# EAGLE design adn_Lego (EAGLE 9.6.2)
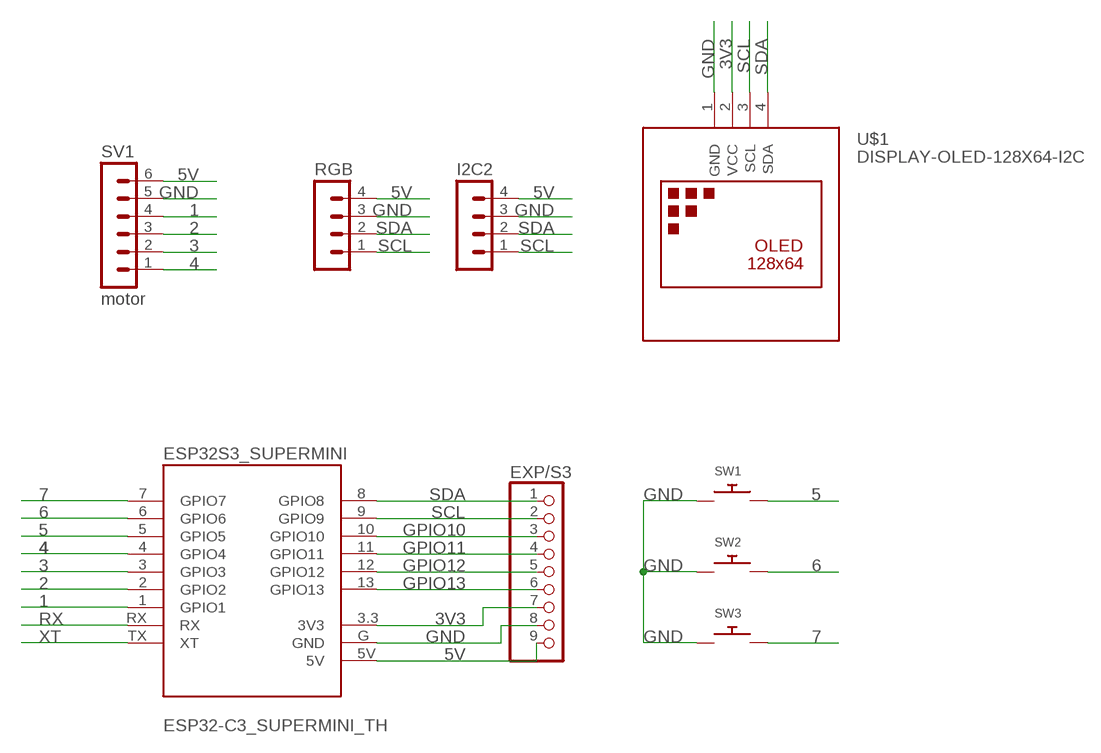
[diagram p0: schematic, sheet 1]

## Parts
ESP32S3_SUPERMINI  ESP32-C3_SUPERMINI_TH  [MODULE_ESP32-C3_SUPERMINI_TH]
EXP/S3  PINHD-1X9  [1X09]
I2C2  MA04-1  [MA04-1]
RGB  MA04-1  [MA04-1]
SV1  motor  MA06-1  [MA06-1]
SW1  SWITCH_PUSHBUTTONEVQ-PE  [TACT_PANA-EVQ]
SW2  SWITCH_PUSHBUTTONEVQ-PE  [TACT_PANA-EVQ]
SW3  SWITCH_PUSHBUTTONEVQ-PE  [TACT_PANA-EVQ]
U$1  DISPLAY-OLED-128X64-I2C  [DISPLAY-OLED-128X64-I2C]

## Nets
1: ESP32S3_SUPERMINI.1(GPIO1) SV1.4
2: ESP32S3_SUPERMINI.2(GPIO2) SV1.3
3: ESP32S3_SUPERMINI.3(GPIO3) SV1.2
3V3: ESP32S3_SUPERMINI.3.3(3V3) EXP/S3.7 U$1.2(VCC)
4: ESP32S3_SUPERMINI.4(GPIO4) SV1.1
5: ESP32S3_SUPERMINI.5(GPIO5) SW1.P$2
5V: ESP32S3_SUPERMINI.5V EXP/S3.9 I2C2.4 RGB.4 SV1.6
6: ESP32S3_SUPERMINI.6(GPIO6) SW2.P$2
7: ESP32S3_SUPERMINI.7(GPIO7) SW3.P$2
GND: ESP32S3_SUPERMINI.G(GND) EXP/S3.8 I2C2.3 RGB.3 SV1.5 SW1.P$1 SW2.P$1 SW3.P$1 U$1.1(GND)
GPIO10: ESP32S3_SUPERMINI.10(GPIO10) EXP/S3.3
GPIO11: ESP32S3_SUPERMINI.11(GPIO11) EXP/S3.4
GPIO12: ESP32S3_SUPERMINI.12(GPIO12) EXP/S3.5
GPIO13: ESP32S3_SUPERMINI.13(GPIO13) EXP/S3.6
RX: ESP32S3_SUPERMINI.RX
SCL: ESP32S3_SUPERMINI.9(GPIO9) EXP/S3.2 I2C2.1 RGB.1 U$1.3(SCL)
SDA: ESP32S3_SUPERMINI.8(GPIO8) EXP/S3.1 I2C2.2 RGB.2 U$1.4(SDA)
XT: ESP32S3_SUPERMINI.TX(XT)

## Library data of the parts
ESP32S3_SUPERMINI = ESP32-S3_SUPERMINI_TH:ESP32-C3_SUPERMINI_TH: Biblioteca modificada para esp32 s3 super mini; AVAILABILITY: Not in stock; DESCRIPTION: Super tiny ESP32-S3; MARCA: model S3 esp32; MF: Espressif Systems; MODEL: esp32 S3; MP: ESP32-S3 SuperMini_TH; PACKAGE: Package
EXP/S3 = pinhead:PINHD-1X9: PIN HEADER
I2C2 RGB = con-lstb:MA04-1: PIN HEADER; OC_FARNELL: unknown; OC_NEWARK: unknown
SV1 = con-lstb:MA06-1: PIN HEADER; OC_FARNELL: unknown; OC_NEWARK: unknown
SW1-SW3 = adafruit:SWITCH_PUSHBUTTON: Buttons SOFTTOUCHSMD_SJ - Soft touch temporary push button (Super Junk Akihabara) Compatible with SKPMANE010 [Mouser: 688-SKPMAN] C&K_KSS = Digikey: KSS221GLFS
U$1 = diy-modules:DISPLAY-OLED-128X64-I2C: 128x64 Dot Matrix OLED Module based on SSD1306 chip Variant with I2C interface More details available here: http://www.instructables.com/id/Monochrome-096-i2c-OLED-display-with-arduino-SSD13/ SSD1306 datasheet: https://cdn-shop.adafruit.com/datasheets/SSD1306.pdf Click here to find device on ebay.com <http://www.ebay.com/sch/oled+display+128x64+iic> Note: There are two variants: I2C and SPI. Search for the proper version.

## Board
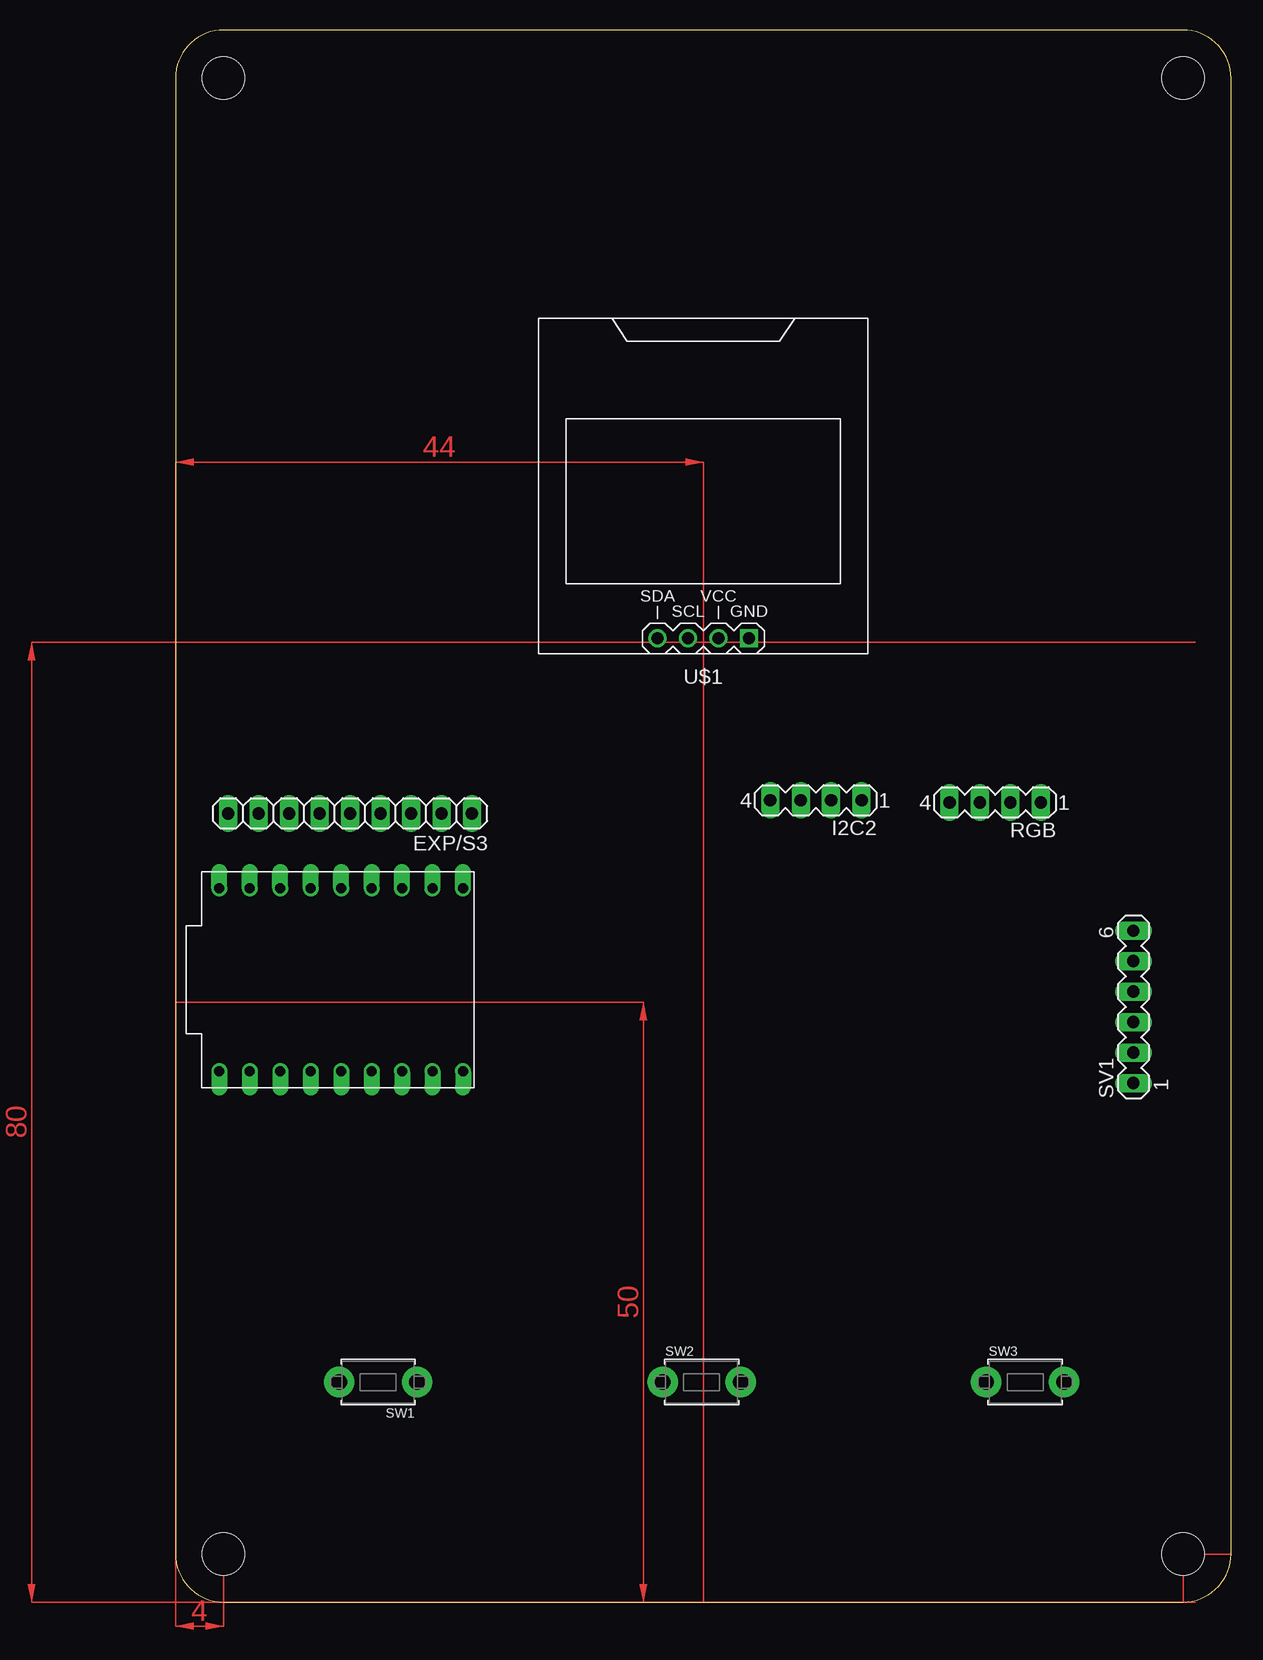
[diagram p1: board, top side]
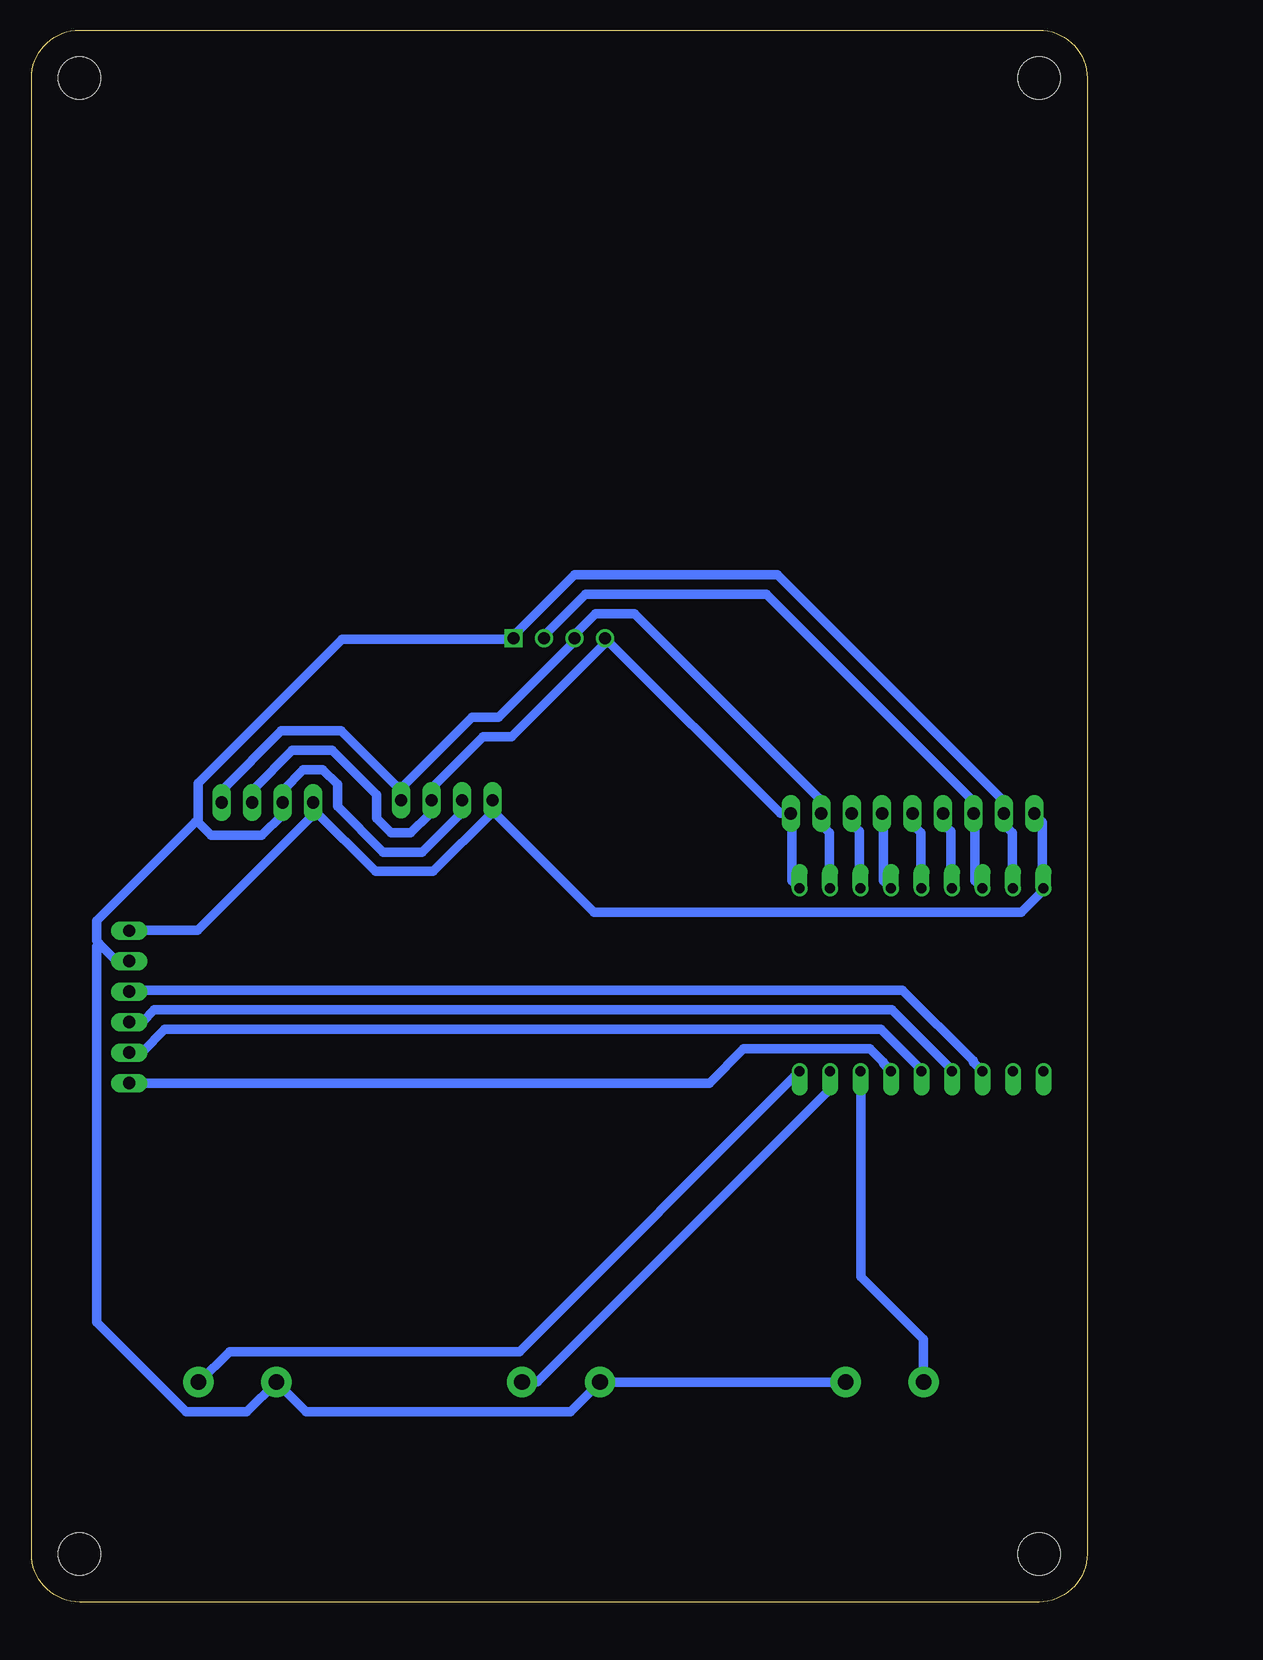
[diagram p2: board, bottom side, seen from below]

Size 88 x 131 mm. Coordinates in mm from the lower left corner, seen from the top.
Outline: 0,127 0,4 arc90 4,0 84,0 arc90 88,4 88,127 arc90 84,131 4,131 arc90 0,127
Copper layers (1*16): Top 0.035mm / dielectric 1.5mm / Bottom 0.035mm
Design rules "default *": minimum track width 0.8mm, minimum drill 0.8mm, track to track 0.8mm, track to pad 0.8mm, pad to pad 0.8mm, via to via 0.8mm, smd to smd 6mil, copper to edge 0.8mm, drill to drill 0.8mm, minimum pad ring 10mil, minimum via ring 8mil, stop-mask expansion 4mil, vias tented up to drill 0mil, thermal gap 10mil
Holes 3.5 mm at 4,127 4,4 84,4 84,127

### Footprints (pad centres in the part's own frame; a part is rotated, then mirrored left to right if it is on the bottom)
MODULE_ESP32-C3_SUPERMINI_TH = drill 0.84 offset: 1 -7.62,4.82; 2 -7.62,2.28; 3 -7.62,-0.26; 3.3 7.62,4.82; 4 -7.62,-2.8; 5 -7.62,-5.34; 5V 7.62,9.9; 6 -7.62,-7.88; 7 -7.62,-10.42; 8 7.62,-10.42; 9 7.62,-7.88; 10 7.62,-5.34; 11 7.62,-2.8; 12 7.62,-0.26; 13 7.62,2.28; G 7.62,7.36; RX -7.62,7.36; TX -7.62,9.9
1X09 = drill 1.016 long: 1 -10.16,0; 2 -7.62,0; 3 -5.08,0; 4 -2.54,0; 5 0,0; 6 2.54,0; 7 5.08,0; 8 7.62,0; 9 10.16,0
MA04-1 = drill 1.016 long: 1 -3.81,0; 2 -1.27,0; 3 1.27,0; 4 3.81,0
MA06-1 = drill 1.016 long: 1 -6.35,0; 2 -3.81,0; 3 -1.27,0; 4 1.27,0; 5 3.81,0; 6 6.35,0
TACT_PANA-EVQ = drill 1.3 pad 2.54: P$1 -3.25,0; P$2 3.25,0
DISPLAY-OLED-128X64-I2C = drill 1 square: 1 -3.81,12.7 | drill 1: 2 -1.27,12.7; 3 1.27,12.7; 4 3.81,12.7

### Placement (x,y rotation side)
ESP32S3_SUPERMINI  13.55,51.85 90 top
EXP/S3  14.55,65.71 180 top
I2C2  53.39,66.81 180 top
RGB  68.34,66.63 180 top
SV1  79.86,49.6 90 top
SW1  16.89,18.32 180 top
SW2  43.86,18.32 0 top
SW3  70.83,18.32 0 top
U$1  44,93 180 top

### Tracks (layer width: path | path; a pad name or v marks a point on that pad's centre or on a via)
1
  Bottom 0.8: ESP32S3_SUPERMINI.1 9.5,45 9.5,45.11 15.39,51 79.62,51 79.76,50.87 SV1.4
2
  Bottom 0.8: SV1.3 79.81,48.38 78.75,48.38 77.78,49.35 16.28,49.35 11.38,44.45 11.38,44.34 ESP32S3_SUPERMINI.2
3
  Bottom 0.8: SV1.2 79.77,45.88 78.75,45.88 76.9,47.73 17.2,47.73 13.88,44.41 13.88,44.3 ESP32S3_SUPERMINI.3
3V3
  Bottom 0.8: U$1.2 45.25,80.32 45.25,80.54 41.82,83.97 26.74,83.97 9.62,66.86 9.62,65.86 EXP/S3.7 9.38,65.61 9.38,60.12 ESP32S3_SUPERMINI.3.3
4
  Bottom 0.8: SV1.1 31.5,43.25 28.65,46.1 18.11,46.1 17,44.99 17,44.88 ESP32S3_SUPERMINI.4
5
  Bottom 0.8: ESP32S3_SUPERMINI.5 18.88,44.22 18.88,27.12 13.64,21.89 SW1.P$2
5V
  Bottom 0.8: SV1.6 79.81,56 74.16,56 64.62,65.54 64.62,66.53 RGB.4 64.53,66.08 59.34,60.89 54.51,60.89 49.62,65.77 49.62,66.77 I2C2.4 49.25,65.62 41.12,57.5 5.5,57.5 3.88,59.12 ESP32S3_SUPERMINI.5V 3.75,59.57 3.75,65 4.39,65.64 EXP/S3.9
6
  Bottom 0.8: SW2.P$2 47.05,18.38 45.83,18.38 21.5,42.7 21.5,44.16 ESP32S3_SUPERMINI.6
7
  Bottom 0.8: SW3.P$2 74.06,18.32 71.5,20.88 47.33,20.88 ESP32S3_SUPERMINI.7
GND
  Bottom 0.8: ESP32S3_SUPERMINI.G 6.25,59.5 6.25,64.12 6.88,64.75 6.88,65.66 EXP/S3.8 7,65.78 7,66.78 25.82,85.6 42.73,85.6 47.81,80.52 U$1.1 47.88,80.25 62.12,80.25 74.12,68.25 74.12,65 | 82.38,54.88 81,53.5 79.88,53.5 SV1.5 | 82.38,54.88 82.58,54.67 82.58,23.33 75.1,15.85 70.05,15.85 SW3.P$1 65.11,15.85 43.08,15.85 SW2.P$1 SW1.P$1 | I2C2.3 52.12,65.81 55.45,62.49 58.67,62.49 62.5,66.31 62.5,68.14 63.72,69.35 65.34,69.35 67,67.7 67,66.7 RGB.3 67.12,66.58 67.12,65.58 68.8,63.91 73.03,63.91 74.12,65 | 74.12,65 74.35,65 82.58,56.76 82.58,55.08 82.38,54.88
GPIO10
  Bottom 0.8: ESP32S3_SUPERMINI.10 19,59.5 19,64.25 19.62,64.88 EXP/S3.3
GPIO11
  Bottom 0.8: EXP/S3.4 17,65.62 17,60.12 ESP32S3_SUPERMINI.11
GPIO12
  Bottom 0.8: ESP32S3_SUPERMINI.12 13.88,59.5 13.88,64.12 14.5,64.75 14.5,65.66 EXP/S3.5
GPIO13
  Bottom 0.8: ESP32S3_SUPERMINI.13 11.38,59.5 11.38,64.25 12,64.88 EXP/S3.6
SCL
  Bottom 0.8: ESP32S3_SUPERMINI.9 21.5,59.5 21.5,64.12 22.12,64.75 22.12,65.67 EXP/S3.2 22.38,66 22.38,67 37.75,82.38 41,82.38 42.75,80.62 U$1.3 42.75,80.28 42.75,80.06 49.06,73.75 51.26,73.75 57.12,67.88 57.12,66.89 I2C2.1 57.2,67.59 62.21,72.6 67.18,72.6 72.12,67.65 72.12,66.66 RGB.1
SDA
  Bottom 0.8: RGB.2 69.5,66.74 69.5,67.74 66.26,70.97 62.96,70.97 59.25,67.26 59.25,65.32 58.01,64.09 56.39,64.09 54.88,65.6 54.88,66.59 I2C2.2 54.62,66.88 54.62,67.88 50.38,72.12 48,72.12 40.25,79.88 U$1.4 40.17,80.3 25.59,65.71 EXP/S3.1 24.62,65.62 24.62,60.12 ESP32S3_SUPERMINI.8
(copper drawn outside any net)
  shapes: Top area x6